# EAGLE design backplane (EAGLE 7.2.0)
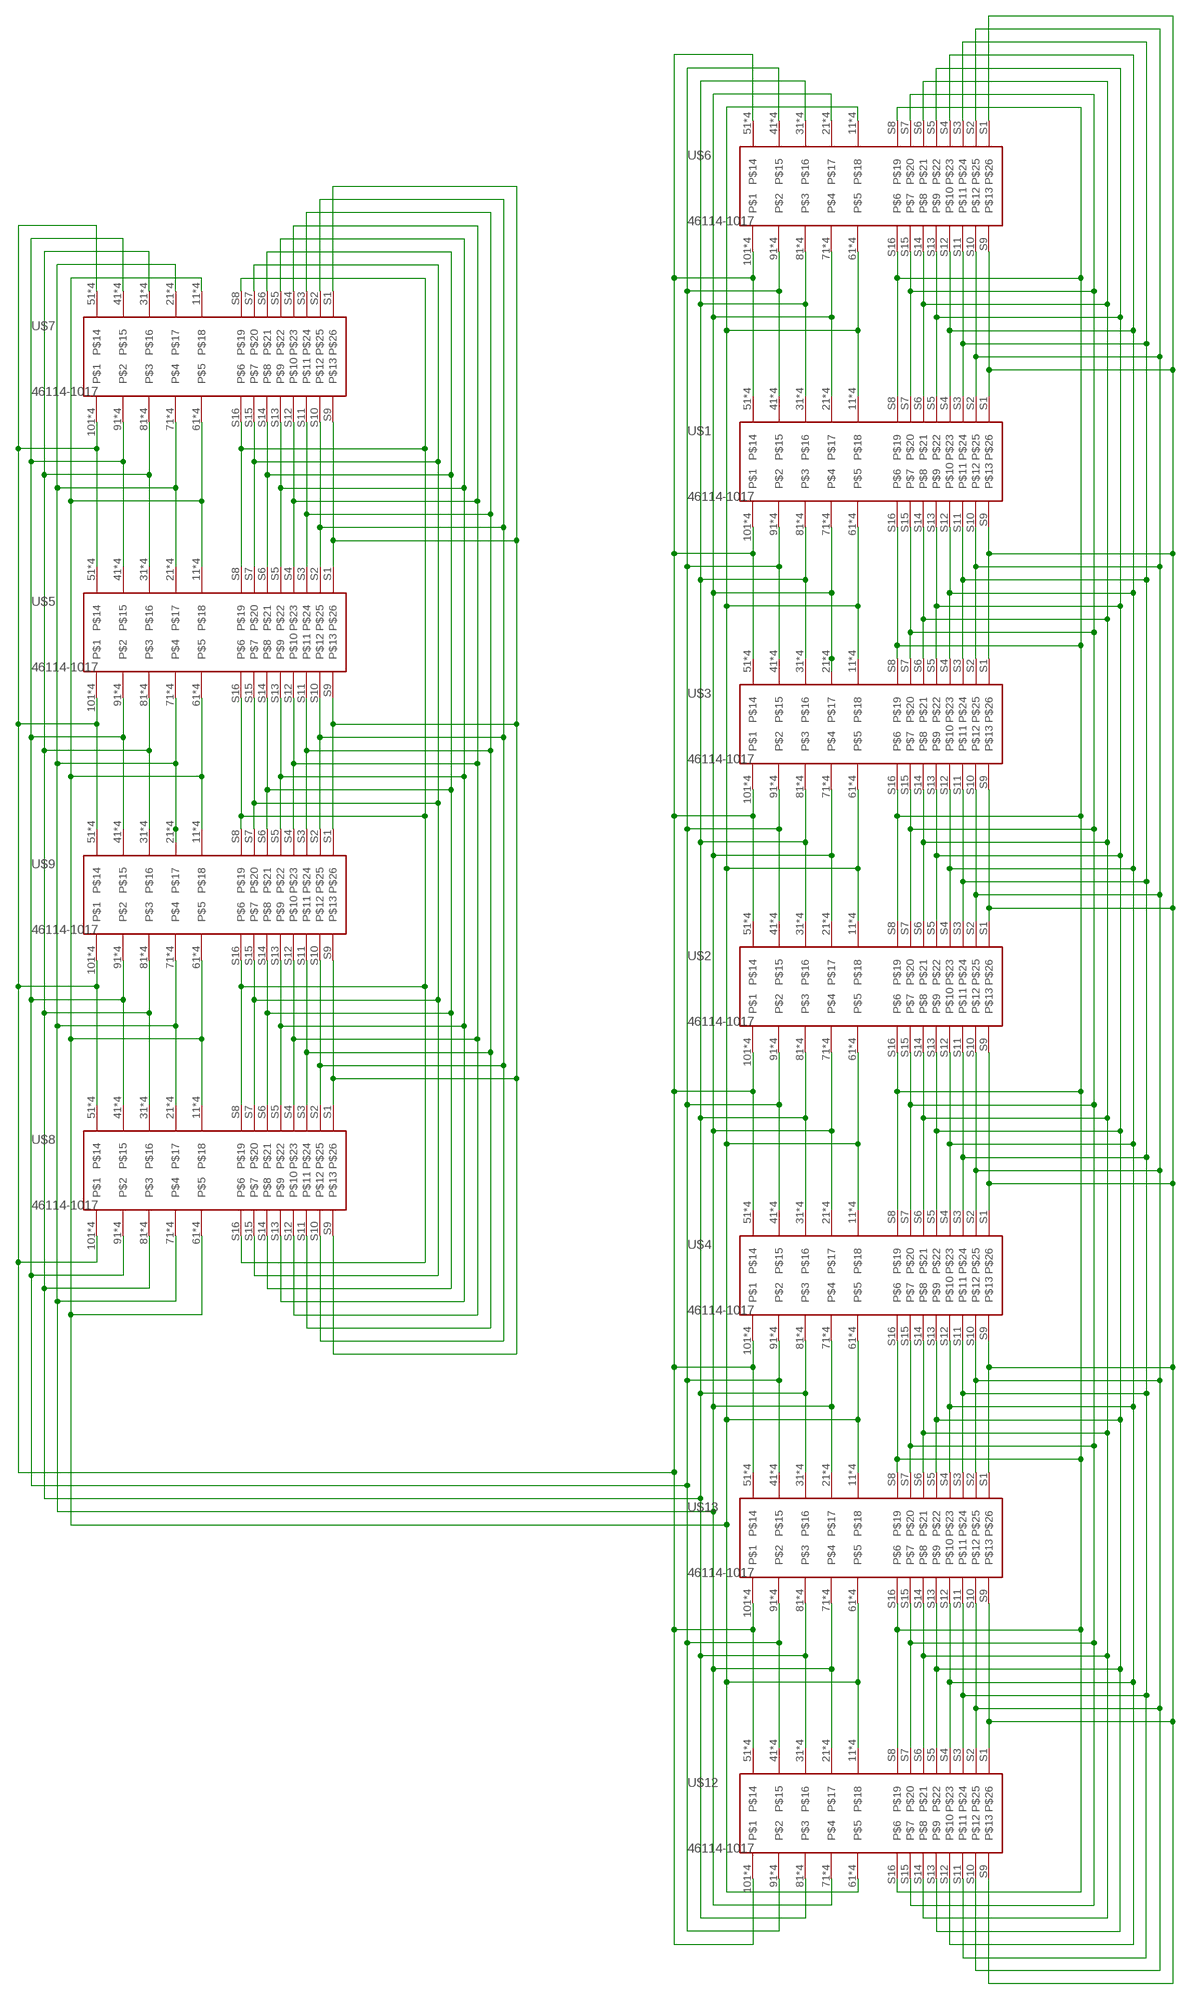
[diagram p0: schematic, sheet 1]

## Parts
U$1  46114-1017  [46114-1017]
U$2  46114-1017  [46114-1017]
U$3  46114-1017  [46114-1017]
U$4  46114-1017  [46114-1017]
U$5  46114-1017  [46114-1017]
U$6  46114-1017  [46114-1017]
U$7  46114-1017  [46114-1017]
U$8  46114-1017  [46114-1017]
U$9  46114-1017  [46114-1017]
U$12  46114-1017  [46114-1017]
U$13  46114-1017  [46114-1017]

## Nets
5V: U$1.11 U$1.12 U$1.13 U$1.14 U$1.61 U$1.62 U$1.63 U$1.64 U$2.11 U$2.12 U$2.13 U$2.14 U$2.61 U$2.62 U$2.63 U$2.64 U$3.11 U$3.12 U$3.13 U$3.14 U$3.61 U$3.62 U$3.63 U$3.64 U$4.11 U$4.12 U$4.13 U$4.14 U$4.61 U$4.62 U$4.63 U$4.64 U$5.11 U$5.12 U$5.13 U$5.14 U$5.61 U$5.62 U$5.63 U$5.64 U$6.11 U$6.12 U$6.13 U$6.14 U$6.61 U$6.62 U$6.63 U$6.64 U$7.11 U$7.12 U$7.13 U$7.14 U$7.61 U$7.62 U$7.63 U$7.64 U$8.11 U$8.12 U$8.13 U$8.14 U$8.61 U$8.62 U$8.63 U$8.64 U$9.11 U$9.12 U$9.13 U$9.14 U$9.61 U$9.62 U$9.63 U$9.64 U$12.11 U$12.12 U$12.13 U$12.14 U$12.61 U$12.62 U$12.63 U$12.64 U$13.11 U$13.12 U$13.13 U$13.14 U$13.61 U$13.62 U$13.63 U$13.64
12V: U$1.21 U$1.22 U$1.23 U$1.24 U$1.71 U$1.72 U$1.73 U$1.74 U$2.21 U$2.22 U$2.23 U$2.24 U$2.71 U$2.72 U$2.73 U$2.74 U$3.21 U$3.22 U$3.23 U$3.24 U$3.71 U$3.72 U$3.73 U$3.74 U$4.21 U$4.22 U$4.23 U$4.24 U$4.71 U$4.72 U$4.73 U$4.74 U$5.21 U$5.22 U$5.23 U$5.24 U$5.71 U$5.72 U$5.73 U$5.74 U$6.21 U$6.22 U$6.23 U$6.24 U$6.71 U$6.72 U$6.73 U$6.74 U$7.21 U$7.22 U$7.23 U$7.24 U$7.71 U$7.72 U$7.73 U$7.74 U$8.21 U$8.22 U$8.23 U$8.24 U$8.71 U$8.72 U$8.73 U$8.74 U$9.21 U$9.22 U$9.23 U$9.24 U$9.71 U$9.72 U$9.73 U$9.74 U$12.21 U$12.22 U$12.23 U$12.24 U$12.71 U$12.72 U$12.73 U$12.74 U$13.21 U$13.22 U$13.23 U$13.24 U$13.71 U$13.72 U$13.73 U$13.74
BAT+: U$1.51 U$1.52 U$1.53 U$1.54 U$1.101 U$1.102 U$1.103 U$1.104 U$2.51 U$2.52 U$2.53 U$2.54 U$2.101 U$2.102 U$2.103 U$2.104 U$3.51 U$3.52 U$3.53 U$3.54 U$3.101 U$3.102 U$3.103 U$3.104 U$4.51 U$4.52 U$4.53 U$4.54 U$4.101 U$4.102 U$4.103 U$4.104 U$5.51 U$5.52 U$5.53 U$5.54 U$5.101 U$5.102 U$5.103 U$5.104 U$6.51 U$6.52 U$6.53 U$6.54 U$6.101 U$6.102 U$6.103 U$6.104 U$7.51 U$7.52 U$7.53 U$7.54 U$7.101 U$7.102 U$7.103 U$7.104 U$8.51 U$8.52 U$8.53 U$8.54 U$8.101 U$8.102 U$8.103 U$8.104 U$9.51 U$9.52 U$9.53 U$9.54 U$9.101 U$9.102 U$9.103 U$9.104 U$12.51 U$12.52 U$12.53 U$12.54 U$12.101 U$12.102 U$12.103 U$12.104 U$13.51 U$13.52 U$13.53 U$13.54 U$13.101 U$13.102 U$13.103 U$13.104
BAT-: U$1.41 U$1.42 U$1.43 U$1.44 U$1.91 U$1.92 U$1.93 U$1.94 U$2.41 U$2.42 U$2.43 U$2.44 U$2.91 U$2.92 U$2.93 U$2.94 U$3.41 U$3.42 U$3.43 U$3.44 U$3.91 U$3.92 U$3.93 U$3.94 U$4.41 U$4.42 U$4.43 U$4.44 U$4.91 U$4.92 U$4.93 U$4.94 U$5.41 U$5.42 U$5.43 U$5.44 U$5.91 U$5.92 U$5.93 U$5.94 U$6.41 U$6.42 U$6.43 U$6.44 U$6.91 U$6.92 U$6.93 U$6.94 U$7.41 U$7.42 U$7.43 U$7.44 U$7.91 U$7.92 U$7.93 U$7.94 U$8.41 U$8.42 U$8.43 U$8.44 U$8.91 U$8.92 U$8.93 U$8.94 U$9.41 U$9.42 U$9.43 U$9.44 U$9.91 U$9.92 U$9.93 U$9.94 U$12.41 U$12.42 U$12.43 U$12.44 U$12.91 U$12.92 U$12.93 U$12.94 U$13.41 U$13.42 U$13.43 U$13.44 U$13.91 U$13.92 U$13.93 U$13.94
GND: U$1.31 U$1.32 U$1.33 U$1.34 U$1.81 U$1.82 U$1.83 U$1.84 U$2.31 U$2.32 U$2.33 U$2.34 U$2.81 U$2.82 U$2.83 U$2.84 U$3.31 U$3.32 U$3.33 U$3.34 U$3.81 U$3.82 U$3.83 U$3.84 U$4.31 U$4.32 U$4.33 U$4.34 U$4.81 U$4.82 U$4.83 U$4.84 U$5.31 U$5.32 U$5.33 U$5.34 U$5.81 U$5.82 U$5.83 U$5.84 U$6.31 U$6.32 U$6.33 U$6.34 U$6.81 U$6.82 U$6.83 U$6.84 U$7.31 U$7.32 U$7.33 U$7.34 U$7.81 U$7.82 U$7.83 U$7.84 U$8.31 U$8.32 U$8.33 U$8.34 U$8.81 U$8.82 U$8.83 U$8.84 U$9.31 U$9.32 U$9.33 U$9.34 U$9.81 U$9.82 U$9.83 U$9.84 U$12.31 U$12.32 U$12.33 U$12.34 U$12.81 U$12.82 U$12.83 U$12.84 U$13.31 U$13.32 U$13.33 U$13.34 U$13.81 U$13.82 U$13.83 U$13.84
S1: U$5.S8 U$5.S16 U$7.S8 U$7.S16 U$8.S8 U$8.S16 U$9.S8 U$9.S16
S2: U$5.S7 U$5.S15 U$7.S7 U$7.S15 U$8.S7 U$8.S15 U$9.S7 U$9.S15
S3: U$5.S6 U$5.S14 U$7.S6 U$7.S14 U$8.S6 U$8.S14 U$9.S6 U$9.S14
S4: U$5.S5 U$5.S13 U$7.S5 U$7.S13 U$8.S5 U$8.S13 U$9.S5 U$9.S13
S5: U$5.S4 U$5.S12 U$7.S4 U$7.S12 U$8.S4 U$8.S12 U$9.S4 U$9.S12
S6: U$5.S3 U$5.S11 U$7.S3 U$7.S11 U$8.S3 U$8.S11 U$9.S3 U$9.S11
S7: U$5.S2 U$5.S10 U$7.S2 U$7.S10 U$8.S2 U$8.S10 U$9.S2 U$9.S10
S8: U$5.S1 U$5.S9 U$7.S1 U$7.S9 U$8.S1 U$8.S9 U$9.S1 U$9.S9
S11: U$1.S8 U$1.S16 U$2.S8 U$2.S16 U$3.S8 U$3.S16 U$4.S8 U$4.S16 U$6.S8 U$6.S16 U$12.S8 U$12.S16 U$13.S8 U$13.S16
S12: U$1.S7 U$1.S15 U$2.S7 U$2.S15 U$3.S7 U$3.S15 U$4.S7 U$4.S15 U$6.S7 U$6.S15 U$12.S7 U$12.S15 U$13.S7 U$13.S15
S13: U$1.S6 U$1.S14 U$2.S6 U$2.S14 U$3.S6 U$3.S14 U$4.S6 U$4.S14 U$6.S6 U$6.S14 U$12.S6 U$12.S14 U$13.S6 U$13.S14
S14: U$1.S5 U$1.S13 U$2.S5 U$2.S13 U$3.S5 U$3.S13 U$4.S5 U$4.S13 U$6.S5 U$6.S13 U$12.S5 U$12.S13 U$13.S5 U$13.S13
S15: U$1.S4 U$1.S12 U$2.S4 U$2.S12 U$3.S4 U$3.S12 U$4.S4 U$4.S12 U$6.S4 U$6.S12 U$12.S4 U$12.S12 U$13.S4 U$13.S12
S16: U$1.S3 U$1.S11 U$2.S3 U$2.S11 U$3.S3 U$3.S11 U$4.S3 U$4.S11 U$6.S3 U$6.S11 U$12.S3 U$12.S11 U$13.S3 U$13.S11
S17: U$1.S2 U$1.S10 U$2.S2 U$2.S10 U$3.S2 U$3.S10 U$4.S2 U$4.S10 U$6.S2 U$6.S10 U$12.S2 U$12.S10 U$13.S2 U$13.S10
S18: U$1.S1 U$1.S9 U$2.S1 U$2.S9 U$3.S1 U$3.S9 U$4.S1 U$4.S9 U$6.S1 U$6.S9 U$12.S1 U$12.S9 U$13.S1 U$13.S9

## Library data of the parts
U$1-U$9 U$12 U$13 = Molex_Edge:46114-1017

## Board
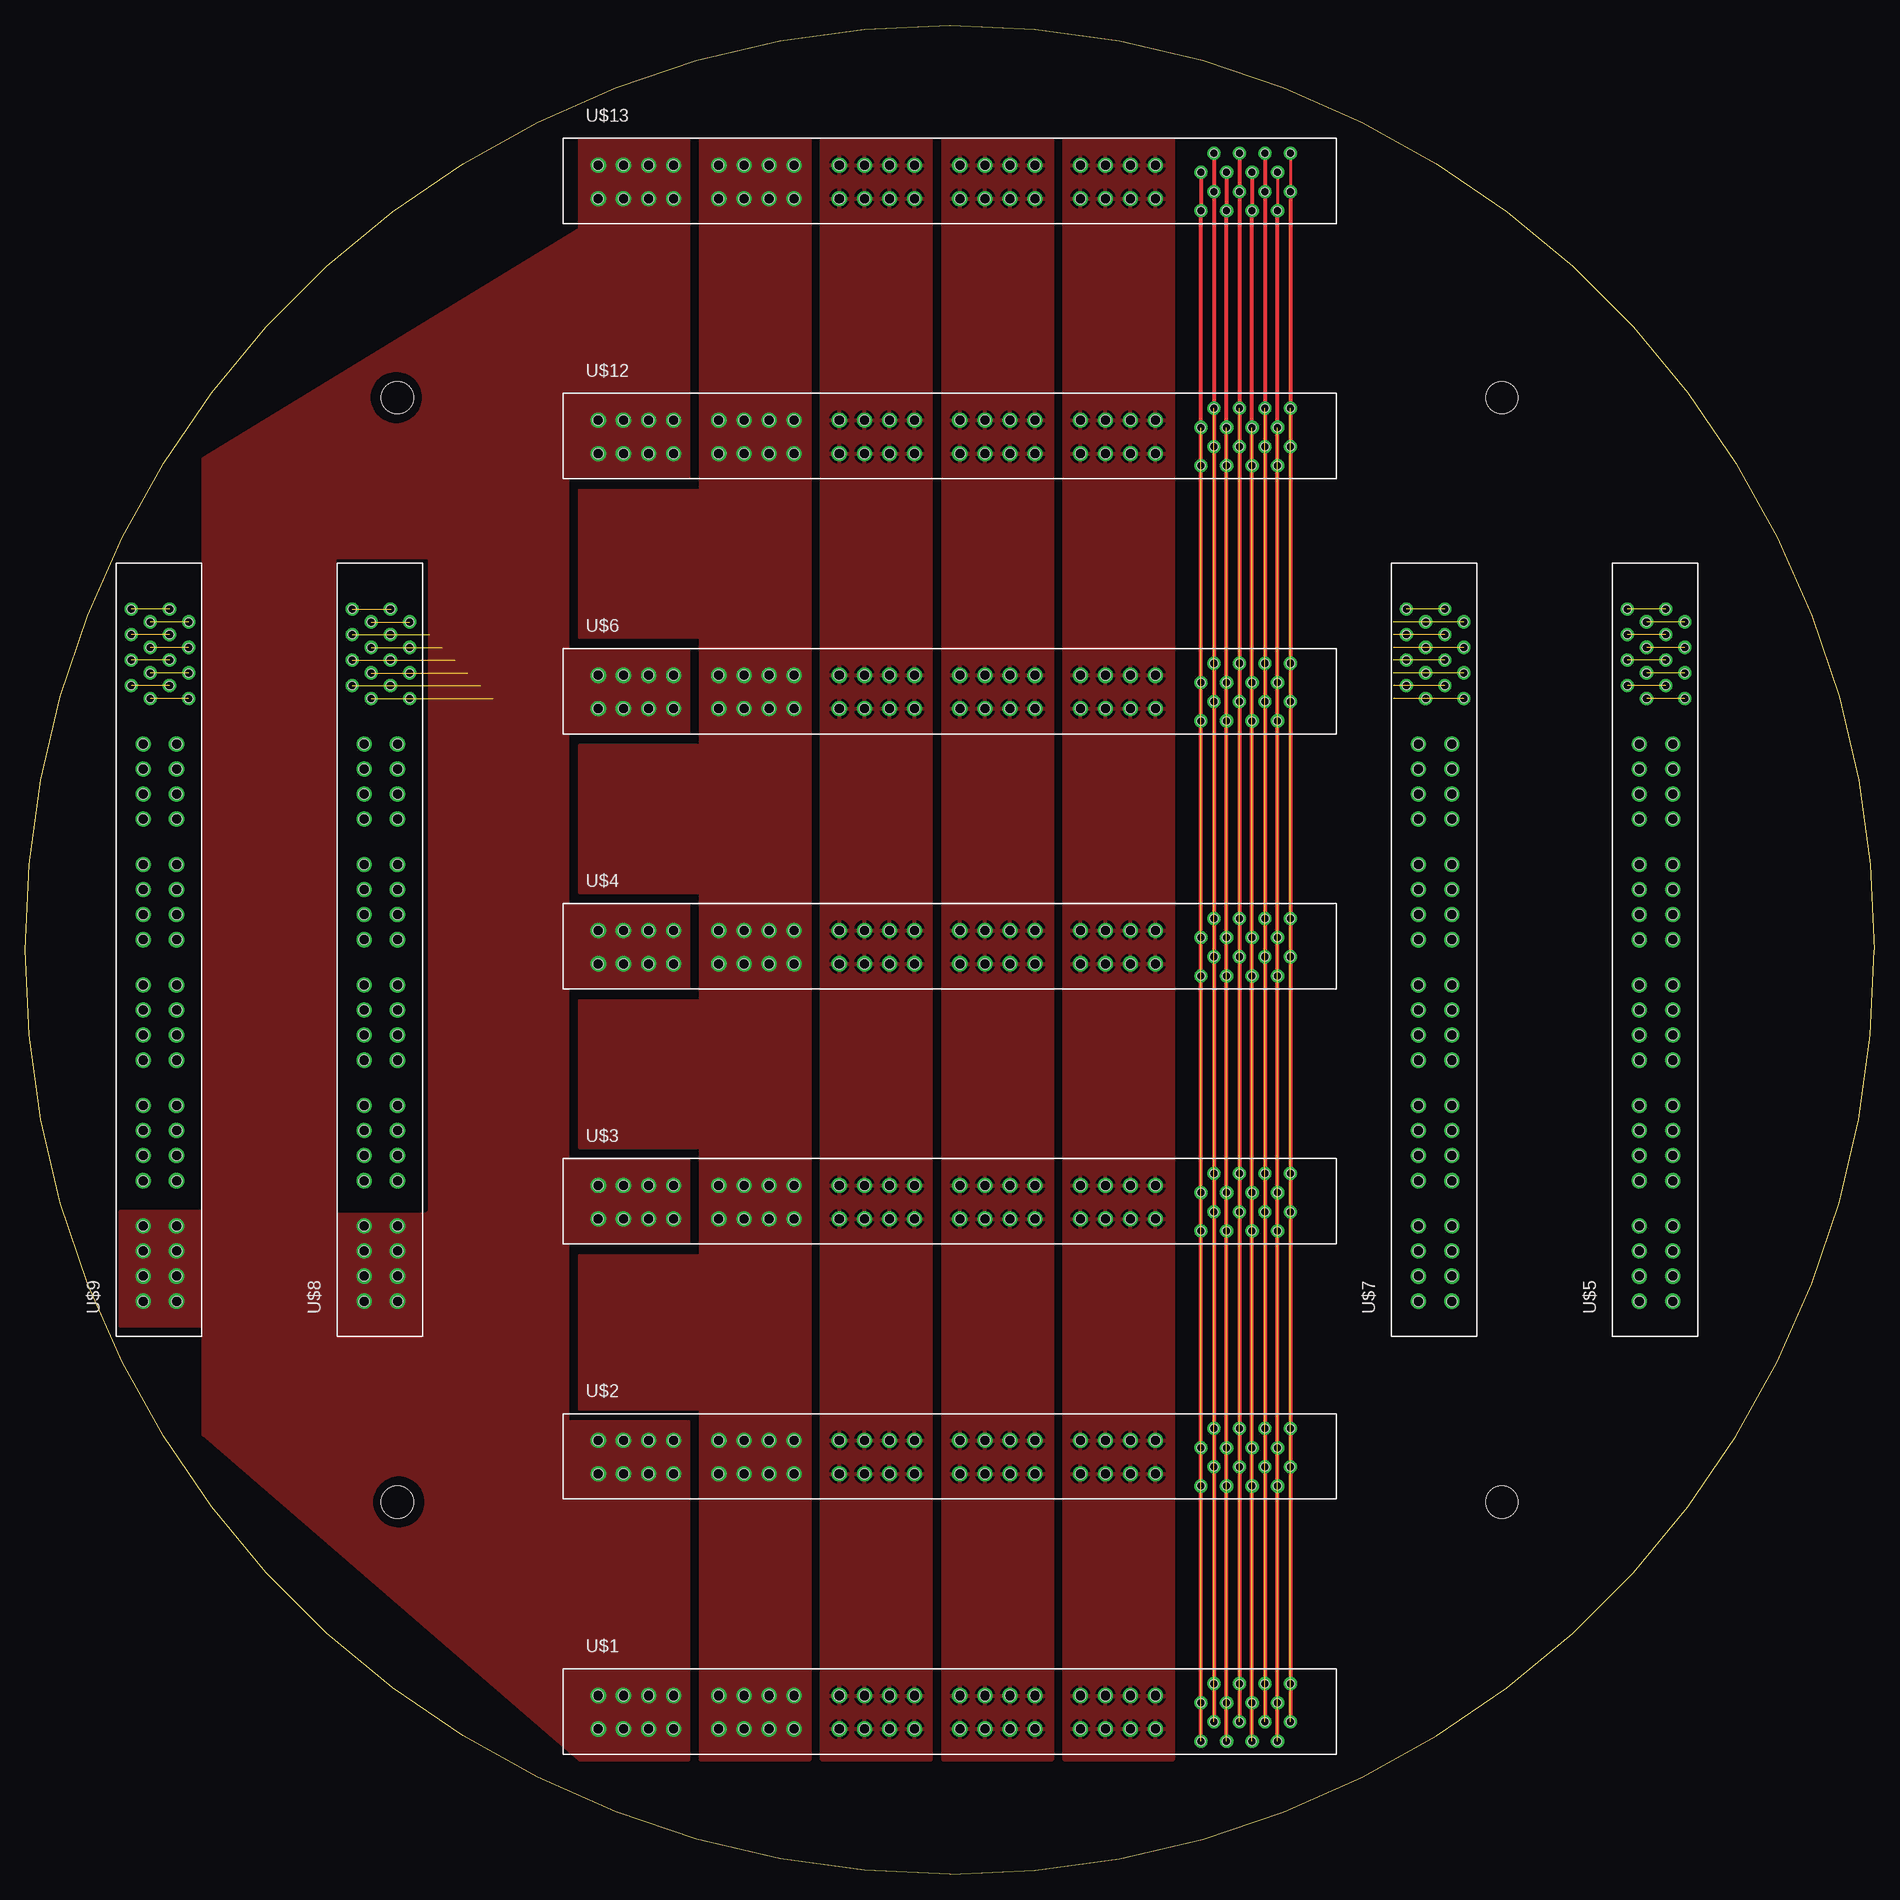
[diagram p1: board, top side]
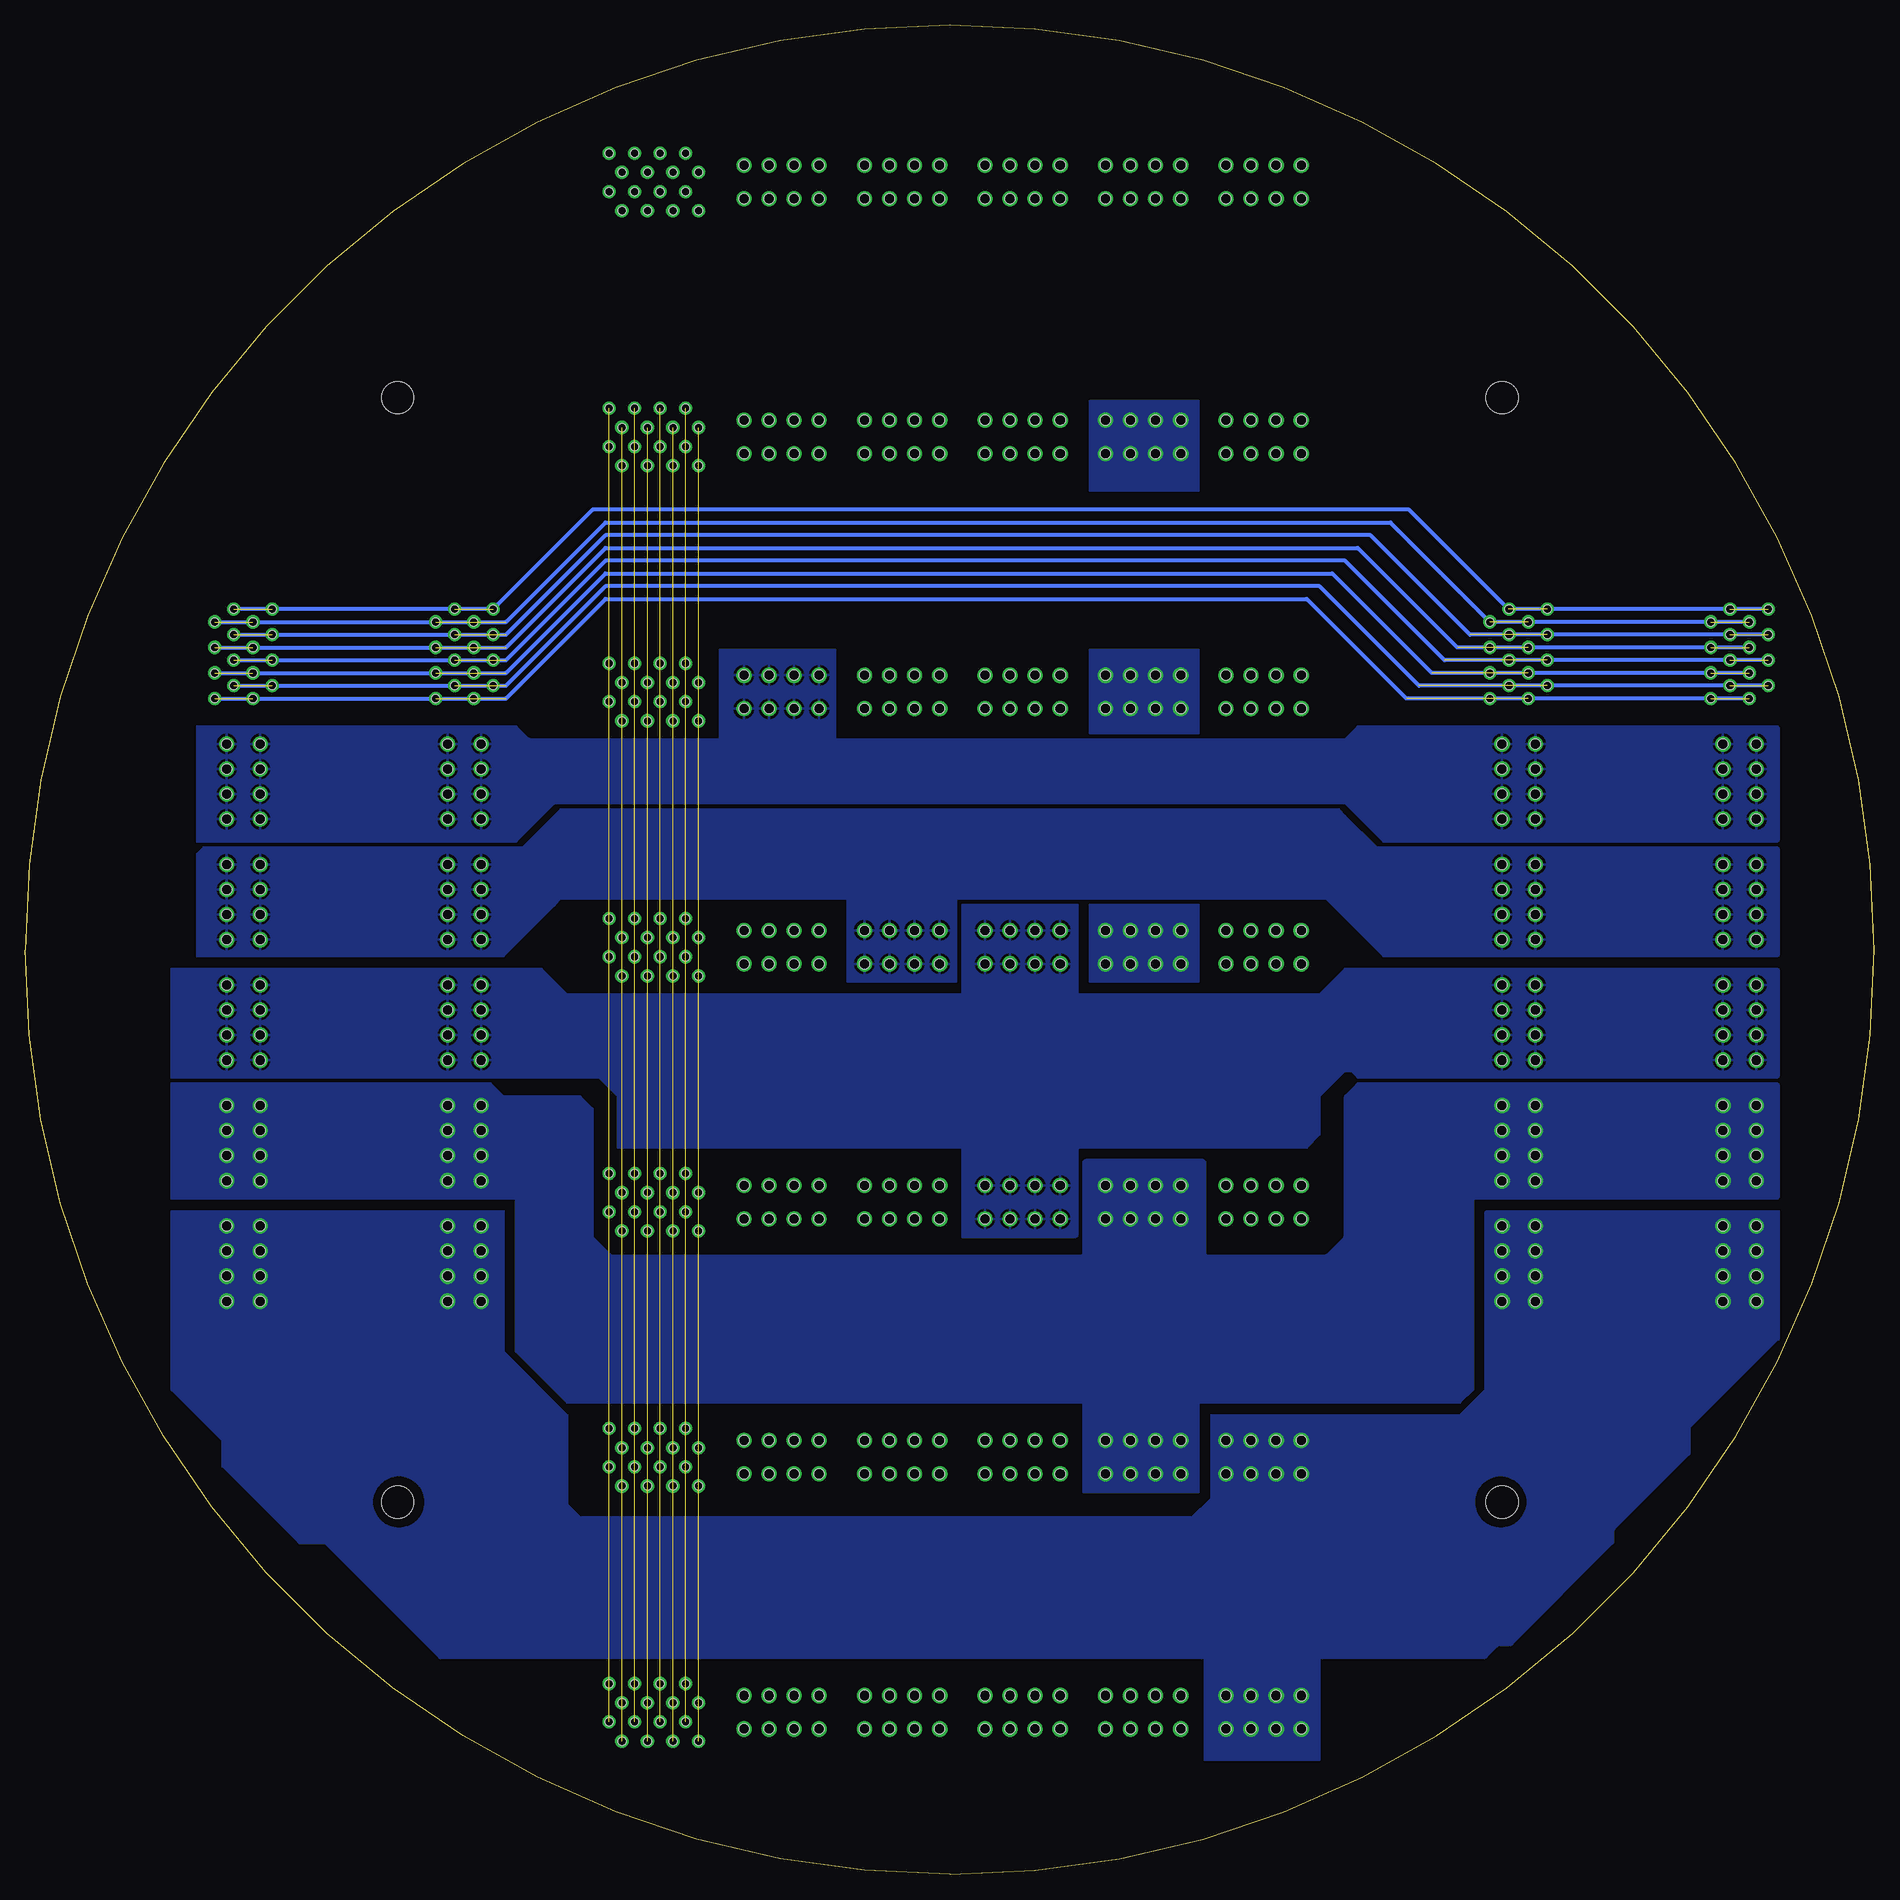
[diagram p2: board, bottom side, seen from below]

Size 184.15 x 184.15 mm. Coordinates in mm from the lower left corner, seen from the top.
Outline: 92.08,0 arc90 184.15,92.08 arc90 92.08,184.15 arc90 0,92.08 arc90 92.08,0
Copper layers (1*16): Top 0.035mm / dielectric 1.5mm / Bottom 0.035mm
Design rules "default *": minimum track width 0mil, minimum drill 0mil, track to track 0mil, track to pad 0mil, pad to pad 8mil, via to via 8mil, smd to smd 8mil, copper to edge 0mil, drill to drill 0mil, minimum pad ring 10mil, minimum via ring 8mil, stop-mask expansion 4mil, vias tented up to drill 0mil, thermal gap 10mil
Holes 3.2 mm at 37.08,37.08 147.07,37.07 147.07,147.07 37.08,147.07

### Footprints (pad centres in the part's own frame; a part is rotated, then mirrored left to right if it is on the bottom)
46114-1017 = drill 1: 11 55.5,3.33; 12 53,3.33; 13 50.5,3.33; 14 48,3.33; 21 43.5,3.33; 22 41,3.33; 23 38.5,3.33; 24 36,3.33; 31 31.5,3.33; 32 29,3.33; 33 26.5,3.33; 34 24,3.33; 41 19.5,3.33; 42 17,3.33; 43 14.5,3.33; 44 12,3.33; 51 7.5,3.33; 52 5,3.33; 53 2.5,3.33; 54 0,3.33; 61 55.5,0; 62 53,0; 63 50.5,0; 64 48,0; 71 43.5,0; 72 41,0; 73 38.5,0; 74 36,0; 81 31.5,0; 82 29,0; 83 26.5,0; 84 24,0; 91 19.5,0; 92 17,0; 93 14.5,0; 94 12,0; 101 7.5,0; 102 5,0; 103 2.5,0; 104 0,0 | drill 0.8: P$50 60.03,-1.21; S1 68.92,4.52; S2 67.65,2.61; S3 66.38,4.52; S4 65.11,2.61; S5 63.84,4.52; S6 62.57,2.61; S7 61.3,4.52; S8 60.03,2.61; S9 68.92,0.7; S10 67.65,-1.21; S11 66.38,0.7; S12 65.11,-1.21; S13 63.84,0.7; S14 62.57,-1.21; S15 61.3,0.7; S16 60.03,-1.21 | hole 1: 0,0; 2.5,0; 5,0; 7.5,0; 12,0; 14.5,0; 17,0; 19.5,0; 24,0; 26.5,0; 29,0; 31.5,0; 36,0; 38.5,0; 41,0; 43.5,0; 50.5,0; 53,0; 55.5,0; 48,0; 0,3.33; 2.5,3.33; 5,3.33; 7.5,3.33; 12,3.33; 14.5,3.33; 17,3.33; 19.5,3.33; 24,3.33; 26.5,3.33; 29,3.33; 31.5,3.33; 36,3.33; 38.5,3.33; 41,3.33; 43.5,3.33; 48,3.33; 50.5,3.33; 53,3.33; 55.5,3.33 | hole 0.8: 61.3,4.52; 63.84,4.52; 66.38,4.52; 68.92,4.52; 60.03,2.61; 62.57,2.61; 65.11,2.61; 67.65,2.61; 61.3,0.7; 63.84,0.7; 66.38,0.7; 68.92,0.7; 60.03,-1.21; 62.57,-1.21; 65.11,-1.21; 67.65,-1.21

### Placement (x,y rotation side)
U$1  57.08,14.48 0 top
U$2  57.08,39.88 0 top
U$3  57.08,65.28 0 top
U$4  57.08,90.68 0 top
U$5  164.07,57.08 90 top
U$6  57.08,116.08 0 top
U$7  142.07,57.08 90 top
U$8  37.08,57.08 90 top
U$9  15.08,57.08 90 top
U$12  57.08,141.48 0 top
U$13  57.08,166.88 0 top

### Tracks (layer width: path | path; a pad name or v marks a point on that pad's centre or on a via)
5V
  pour Top: 103.5,172.72 114.3,172.72 114.3,11.43 103.5,11.43
  pour Bottom: 9.53,103.12 9.53,114.05 arc-90 9.78,114.3 51.44,114.3 52.71,113.03 103.5,113.03 103.5,121.92 114.94,121.92 114.94,113.03 133.88,113.03 arc45 134.06,113.1 135.25,114.3 167,114.3 167,102.87 135.25,102.87 131.44,106.68 52.71,106.68 48.9,102.87 9.78,102.87 arc-90
12V
  pour Top: 91.44,172.72 102.23,172.72 102.23,11.43 91.44,11.43
  pour Bottom: 48.9,91.44 9.78,91.44 arc-90 9.53,91.69 9.53,101.98 arc-90 9.78,102.23 49.53,102.23 52.71,105.41 53.34,106.05 130.81,106.05 134.62,102.23 166.37,102.23 167,101.6 167,91.44 136.53,91.44 131.44,96.52 130.81,97.16 102.23,97.16 102.23,88.9 91.44,88.9 91.44,97.16 54.61,97.16
BAT+
  pour Top (no thermals): 55.25,172.72 66.04,172.72 66.04,139.06 53.98,139.06 53.98,121.92 66.04,121.92 66.04,113.67 53.98,113.67 53.98,96.52 66.04,96.52 66.04,88.27 53.98,88.27 53.98,71.12 66.04,71.12 66.04,62.87 53.98,62.87 53.98,45.09 66.04,45.09 66.04,11.43 55.25,11.43 17.78,43.81 17.78,54.61 9.53,54.61 9.53,55.24 9.53,66.04 17.78,66.04 17.78,140.97 55.25,163.83
  pour Bottom (no thermals): 9.53,66.04 9.53,53.45 arc45 9.6,53.27 18.42,44.45 18.42,42.02 arc45 18.49,41.84 25.96,34.36 arc-45 26.03,34.18 26.03,33.13 arc45 26.11,32.95 36.12,22.93 arc45 36.3,22.86 37.36,22.86 arc-45 37.54,22.79 38.66,21.66 arc45 38.84,21.59 55.25,21.59 55.25,11.43 66.68,11.43 66.68,21.59 142.88,21.59 154.31,33.02 156.84,33.02 164.47,40.64 164.47,43.18 169.55,48.26 169.55,66.04 136.53,66.04 136.53,52.07 130.18,45.72 130.18,36.83 128.91,35.56 67.95,35.56 66.04,37.47 66.04,45.72 41.28,45.72 38.73,48.26 38.73,65.79 arc90 38.48,66.04
BAT-
  pour Top (no thermals): 67.31,172.72 78.11,172.72 78.11,11.43 67.31,11.43 67.31,46.35 55.25,46.35 55.25,61.59 67.31,61.59 67.31,72.39 55.25,72.39 55.25,87 67.31,87 67.31,97.79 55.25,97.79 55.25,112.39 67.31,112.39 67.31,123.19 55.25,123.19 55.25,137.79 67.31,137.79
  pour Bottom (no thermals): 125.73,61.59 78.99,61.59 arc-90 78.74,61.85 78.74,70.87 arc90 78.49,71.12 66.93,71.12 arc90 66.68,70.87 66.68,61.85 arc-90 66.42,61.59 54.72,61.59 arc-45 54.54,61.67 52.78,63.43 arc-45 52.71,63.61 52.71,77.36 arc45 52.63,77.54 51.51,78.67 arc45 51.33,78.74 9.78,78.74 arc90 9.53,78.49 9.53,67.56 arc90 9.78,67.31 39.75,67.31 arc-90 40.01,67.06 40.01,48.26 41.28,46.99 67.31,46.99 67.31,38.1 78.74,38.1 78.74,46.99 130.18,46.99 135.25,52.07 135.25,67.31 169.55,67.31 169.55,78.74 137.8,78.74 136.53,77.47 128.91,77.47 127.64,76.2 127.64,63.5
  pour Bottom (no thermals): 67.95,121.92 67.31,121.92 67.31,113.67 78.11,113.67 78.11,121.92
  pour Bottom (no thermals): 67.95,96.52 78.11,96.52 78.11,88.9 67.31,88.9 67.31,96.52
  pour Bottom (no thermals): 67.31,146.69 78.11,146.69 78.11,137.79 67.31,137.79
GND
  pour Top: 79.38,172.72 90.17,172.72 90.17,11.43 79.38,11.43
  pour Bottom: 51.44,79.38 9.78,79.38 arc-90 9.53,79.63 9.53,89.92 arc-90 9.78,90.17 52.71,90.17 55.25,87.63 79.38,87.63 79.38,96.52 90.81,96.52 90.81,87.63 130.18,87.63 132.72,90.17 169.55,90.17 169.55,79.38 127,79.38 125.09,77.47 125.09,72.39 90.81,72.39 90.81,63.5 79.63,63.5 arc-90 79.38,63.75 79.38,72.14 arc90 79.12,72.39 56.52,72.39 55.25,73.66 55.25,77.47 52.71,80.01 52.07,80.01
N$1
  cutout Top: 31.12,130.81 40.01,130.81 40.01,66.29 arc-90 39.75,66.04 31.12,66.04
N$2
  cutout Top: 36.96,149.61 arc-90 39.5,147.07 arc-90 36.96,144.53 arc-90 34.42,147.07 arc-90
N$3
  cutout Bottom: 37.21,39.62 arc-90 39.75,37.08 arc-90 37.21,34.54 arc-90 34.67,37.08 arc-90
N$4
  cutout Top: 37.21,39.62 arc-90 39.75,37.08 arc-90 37.21,34.54 arc-90 34.67,37.08 arc-90
N$5
  cutout Bottom: 146.94,39.62 arc-90 149.48,37.08 arc-90 146.94,34.54 arc-90 144.4,37.08 arc-90
S1  (6 unrouted)
  Bottom 0.406: U$5.S16 136.26,117.11 126.37,127 56.52,127 46.62,117.11 U$9.S8
S2  (6 unrouted)
  Bottom 0.406: U$9.S7 45.35,118.38 55.25,128.27 126.37,128.27 136.26,118.38 U$5.S15
S3  (6 unrouted)
  Bottom 0.406: U$5.S14 136.26,119.64 126.37,129.54 53.98,129.54 44.08,119.64 U$9.S6
S4  (6 unrouted)
  Bottom 0.406: U$9.S5 42.81,120.92 52.71,130.81 126.37,130.81 136.26,120.92 U$5.S13
S5  (6 unrouted)
  Bottom 0.406: U$5.S12 136.26,122.19 126.37,132.08 51.44,132.08 41.54,122.19 U$9.S4
S6  (6 unrouted)
  Bottom 0.406: U$9.S3 40.27,123.45 50.17,133.35 126.37,133.35 136.26,123.45 U$5.S11
S7  (5 unrouted)
  Bottom 0.406: U$5.S10 136.26,124.72 126.37,134.62 48.18,134.62 U$8.S10 U$9.S2
S8  (5 unrouted)
  Bottom 0.406: U$9.S1 36.46,126 46.36,135.89 127.66,135.89 U$7.S1 U$5.S9
S11  (11 unrouted)
  Top 0.406: U$13.S8 U$13.S16 U$1.S16
S12  (11 unrouted)
  Top 0.406: U$13.S7 U$13.S15 U$1.S15
S13  (11 unrouted)
  Top 0.406: U$13.S6 U$13.S14 U$1.S14
S14  (11 unrouted)
  Top 0.406: U$13.S5 U$13.S13 U$1.S13
S15  (11 unrouted)
  Top 0.406: U$13.S4 U$13.S12 U$1.S12
S16  (11 unrouted)
  Top 0.406: U$13.S3 U$13.S11 U$1.S11
S17  (11 unrouted)
  Top 0.305: U$13.S2 U$13.S10
  Top 0.406: U$1.S10 U$13.S10
S18  (11 unrouted)
  Top 0.305: U$13.S1 U$13.S9
  Top 0.406: U$13.S9 U$1.S9